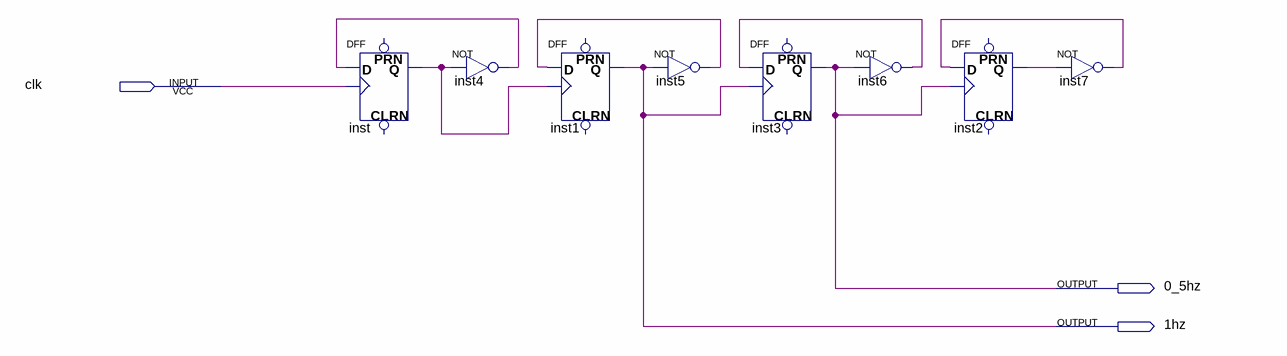
[diagram p0: schematic sheet]
// Quartus schematic clockdiv.bdf as structural Verilog: 8 symbols, 3 pins
module clockdiv (
  input  clk,
  output \0_5hz ,
  output \1hz 
);

  wire inst2_q, inst4_out, inst5_out, inst6_out, inst7_out, inst_q;

  DFF inst (.CLK(clk), .D(inst4_out), .Q(inst_q));  // open: CLRN, PRN
  not inst4 (inst4_out, inst_q);
  DFF inst1 (.CLK(inst_q), .D(inst5_out), .Q(\1hz ));  // open: CLRN, PRN
  not inst5 (inst5_out, \1hz );
  DFF inst3 (.CLK(\1hz ), .D(inst6_out), .Q(\0_5hz ));  // open: CLRN, PRN
  not inst6 (inst6_out, \0_5hz );
  DFF inst2 (.CLK(\0_5hz ), .D(inst7_out), .Q(inst2_q));  // open: CLRN, PRN
  not inst7 (inst7_out, inst2_q);
endmodule
